# EAGLE design cheerlights (EAGLE 7.6.0)
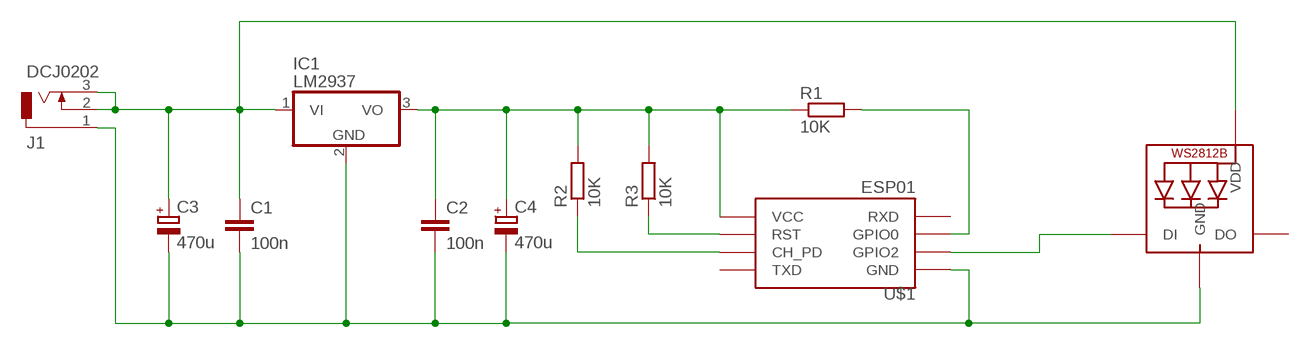
[diagram p0: schematic, sheet 1]

## Parts
C1  100n  C-EU050-025X075  [C050-025X075]
C2  100n  C-EU050-025X075  [C050-025X075]
C3  470u  CPOL-EUE5-10.5  [E5-10,5]
C4  470u  CPOL-EUE5-10.5  [E5-10,5]
IC1  LM2937  7805T  [TO220H]
J1  DCJ0202  [DCJ0202]
LED1  WS2812B_5050N  [WS2812B-NARROW]
R1  10K  R-EU_0207/10  [0207/10]
R2  10K  R-EU_0207/15  [0207/15]
R3  10K  R-EU_0207/15  [0207/15]
U$1  ESP01  [ESP01]

## Nets
N$1: C1.1 C3.+ IC1.1(VI) J1.2 J1.3 LED1.1-VDD(VDD)
N$2: C1.2 C2.2 C3.- C4.- IC1.2(GND) J1.1 LED1.3-GND(GND) U$1.GND
N$3: C2.1 C4.+ IC1.3(VO) R1.1 R2.2 R3.2 U$1.VCC
N$4: R1.2 U$1.GPIO0
N$5: R3.1 U$1.RST
N$6: R2.1 U$1.CH_PD
N$7: LED1.4-DIN(DI) U$1.GPIO2
Unconnected: LED1.2-DOUT(DO) U$1.RX(RXD) U$1.TX(TXD)

## Library data of the parts
C1 C2 = rcl:C-EU: CAPACITOR, European symbol
C3 C4 = rcl:CPOL-EU: POLARIZED CAPACITOR, European symbol
IC1 = adafruit:78*: Positive VOLTAGE REGULATOR Added bigger pads to the TO-92 package
J1 = con-jack:DCJ0202: DC POWER JACK Source: DCJ0202.pdf; OC_FARNELL: unknown; OC_NEWARK: unknown
LED1 = adafruit:WS2812B
R1-R3 = rcl:R-EU_: RESISTOR, European symbol
U$1 = esp8266modules:ESP01: ESP8266 Wifi module 01

## Board
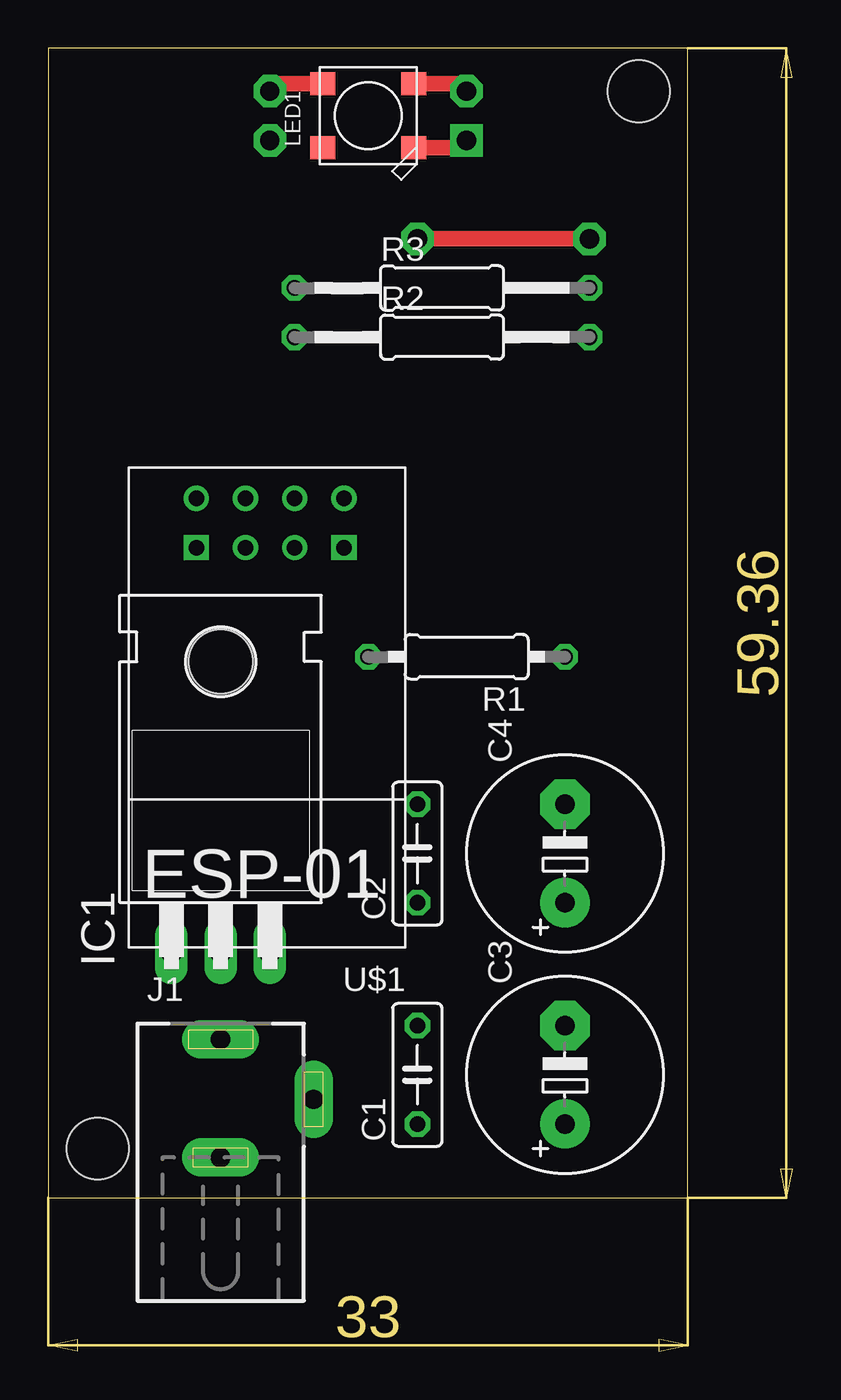
[diagram p1: board, top side]
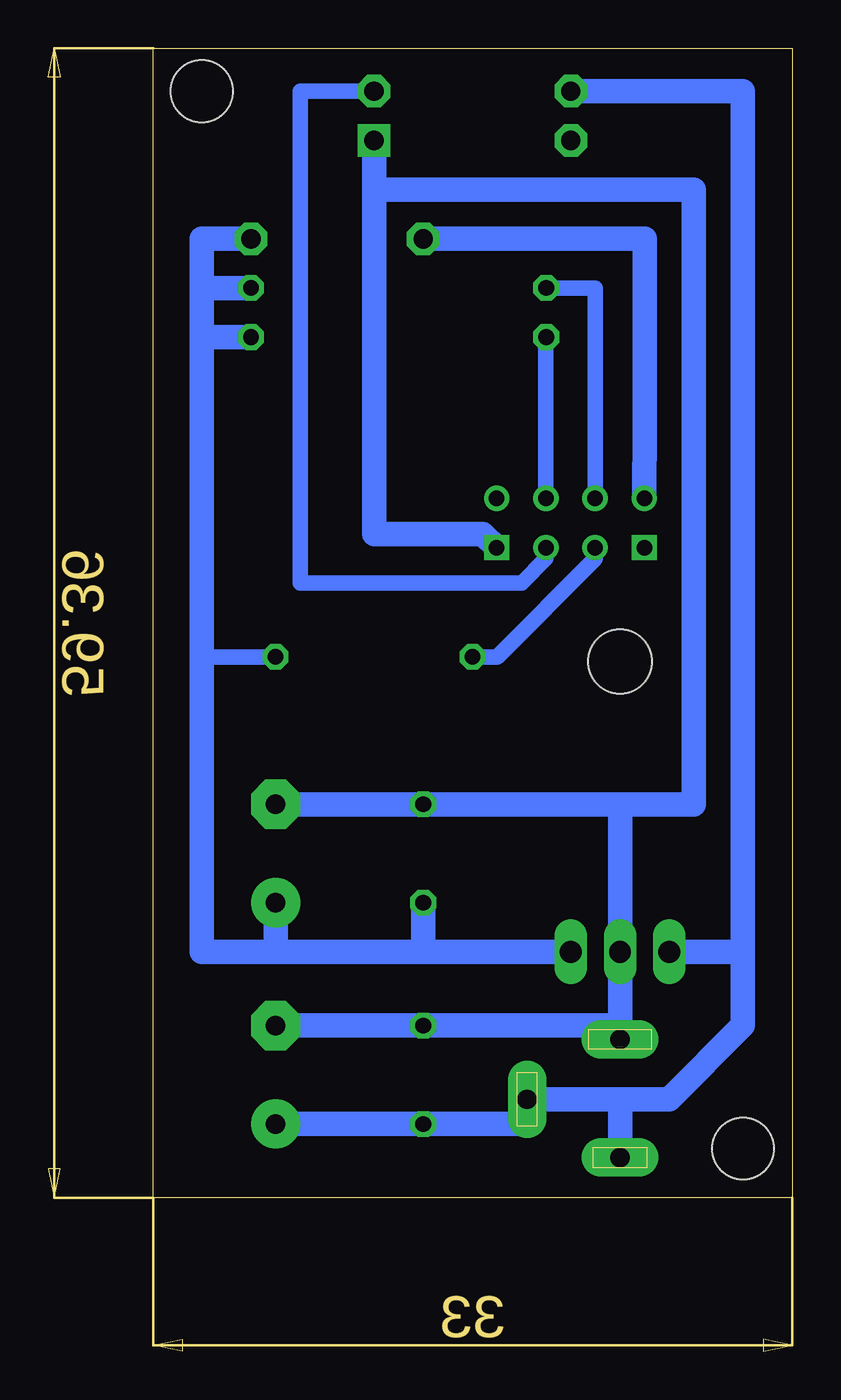
[diagram p2: board, bottom side, seen from below]

Size 33 x 59.36 mm. Coordinates in mm from the lower left corner, seen from the top.
Outline: 0,0 33,0 33,59.36 0,59.36 0,0
Copper layers (1*16): Top 0.035mm / dielectric 1.5mm / Bottom 0.035mm
Design rules "default": minimum track width 10mil, minimum drill 24mil, track to track 8mil, track to pad 8mil, pad to pad 8mil, via to via 8mil, smd to smd 8mil, copper to edge 40mil, drill to drill 8mil, minimum pad ring 10mil, minimum via ring 8mil, stop-mask expansion 4mil, vias tented up to drill 0mil, thermal gap 10mil
Holes 3.2 mm at 30.48,57.15 2.54,2.54

### Footprints (pad centres in the part's own frame; a part is rotated, then mirrored left to right if it is on the bottom)
C050-025X075 = drill 0.813 octagon: 1 -2.54,0; 2 2.54,0
E5-10,5 = drill 1.016 pad 2.54: + -2.54,0 | drill 1.016 pad 2.54 octagon: - 2.54,0
TO220H = drill 1.118 long: 1 -2.54,-10.16; 2 0,-10.16; 3 2.54,-10.16 | hole 3.302: 0,4.826
DCJ0202 = drill 1 pad 2 long: 1 0,3.1; 2 4.8,0; 3 0,-3
WS2812B-NARROW = smd 1.3 x 1.2: 1-VDD 2.35,-1.65; 2-DOUT 2.35,1.65; 3-GND -2.35,1.65; 4-DIN -2.35,-1.65
0207/10 = drill 0.813 octagon: 1 -5.08,0; 2 5.08,0
0207/15 = drill 0.813 octagon: 1 -7.62,0; 2 7.62,0
ESP01 = drill 0.8: CH_PD -1.285,-8.178; GPIO0 1.255,-5.638; GPIO2 -1.285,-5.638; RST 1.255,-8.178; TX -3.825,-8.178; VCC 3.795,-8.178 | drill 0.8 square: GND -3.825,-5.638; RX 3.795,-5.638

### Placement (x,y rotation side)
C1  19.05,6.35 90 top
C2  19.05,17.78 90 top
C3  26.67,6.35 90 top
C4  26.67,17.78 90 top
IC1  8.89,22.86 0 top
J1  8.89,5.08 0 top
LED1  16.51,55.88 180 top
R1  21.59,27.94 180 top
R2  20.32,44.45 0 top
R3  20.32,46.99 0 top
U$1  11.43,27.94 180 top

### Tracks (layer width: path | path; a pad name or v marks a point on that pad's centre or on a via)
N$1  (via drill 1 pad 1.68)
  Top 0.813: LED1.1-VDD 11.43,57.53 v11.43,57.15
  Bottom 1.27: C3.+ C1.1 13.69,3.81 J1.2 8.89,5.08 | 2.54,12.7 IC1.1 | v11.43,57.15 2.54,57.15 2.54,12.7 | 8.89,5.08 6.35,5.08 2.54,8.89 2.54,12.7 | J1.3 8.89,5.08
N$2  (via drill 1 pad 1.68)
  Top 0.813: LED1.3-GND 21.59,54.23 v21.59,54.61
  Bottom 1.27: C3.- C1.2 8.89,8.89 J1.1 IC1.2 8.89,20.32 | C4.- C2.2 8.89,20.32 | v21.59,54.61 21.59,52.07 | 21.59,52.07 21.59,34.29 15.97,34.29 U$1.GND | 8.89,20.32 5.08,20.32 5.08,52.07 21.59,52.07
N$3  (via drill 1 pad 1.68)
  Top 0.813: v19.05,49.53 v27.94,49.53
  Bottom 0.813: R1.1 30.48,27.94
  Bottom 1.27: IC1.3 19.05,12.7 | 19.05,12.7 C2.1 | 30.48,44.45 30.48,27.94 30.48,12.7 26.67,12.7 | R2.2 30.48,44.45 | R3.2 30.48,46.99 | 30.48,46.99 30.48,44.45 | U$1.VCC 7.62,39.93 7.62,49.53 v19.05,49.53 | v27.94,49.53 30.48,49.53 30.48,46.99 | C4.+ 26.67,12.7 | 26.67,12.7 19.05,12.7
N$4
  Bottom 0.813: R1.2 15.24,27.94 10.16,33.02 10.16,33.56 U$1.GPIO0
N$5
  Bottom 0.813: R3.1 10.17,46.99 U$1.RST
N$6
  Bottom 0.813: R2.1 12.71,44.45 U$1.CH_PD
N$7  (via drill 1 pad 1.68)
  Top 0.813: LED1.4-DIN 21.59,57.53 v21.59,57.15
  Bottom 0.813: v21.59,57.15 25.4,57.15 25.4,31.75 13.97,31.75 12.71,33.01 U$1.GPIO2
N$8  (via drill 1 pad 1.68)
  other vias: 11.43,54.61